# EAGLE board Z-ONE (EAGLE 7.2.0), part 1 of 2
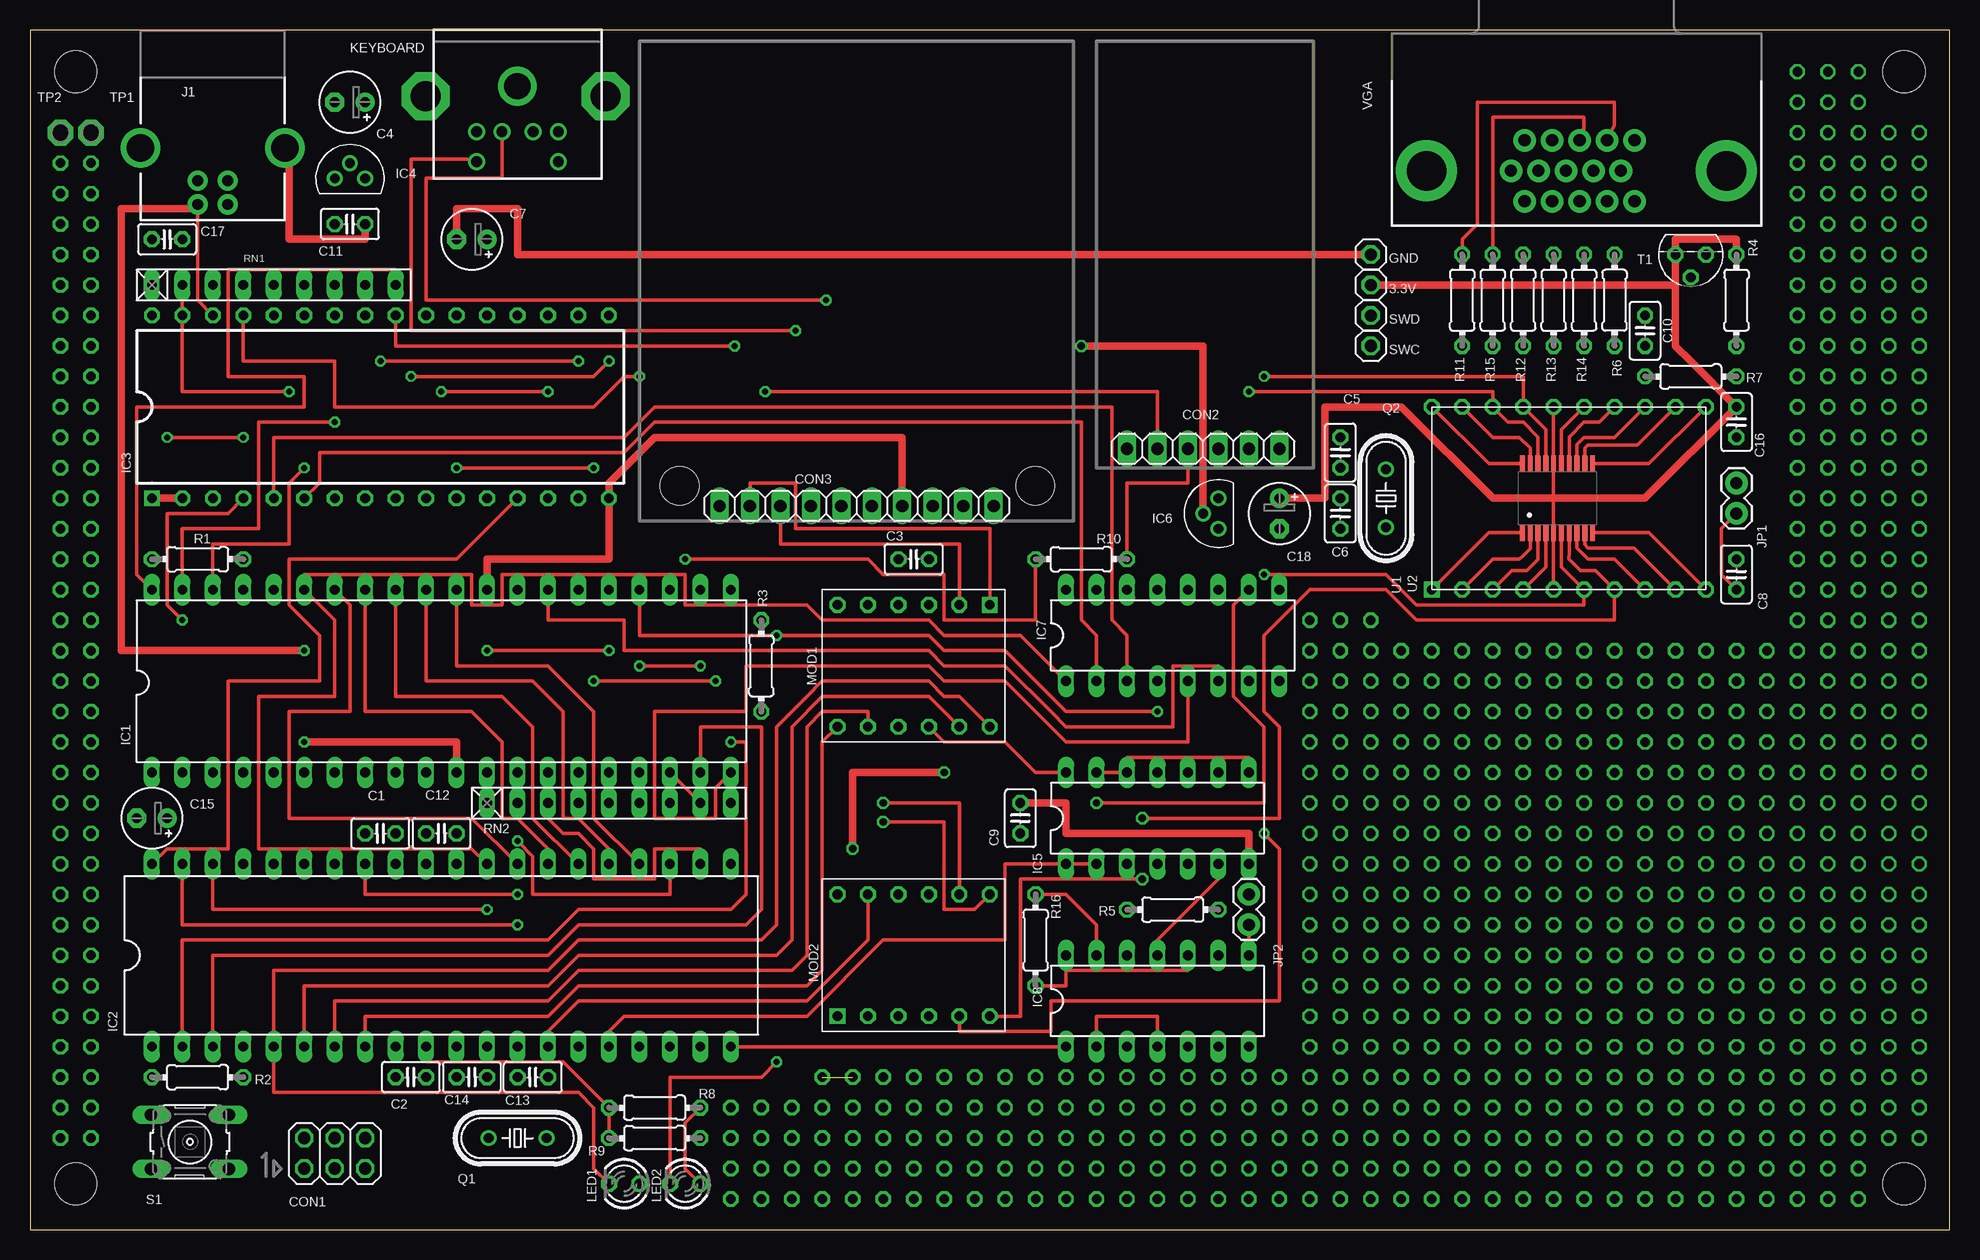
[diagram p1: board, top side]
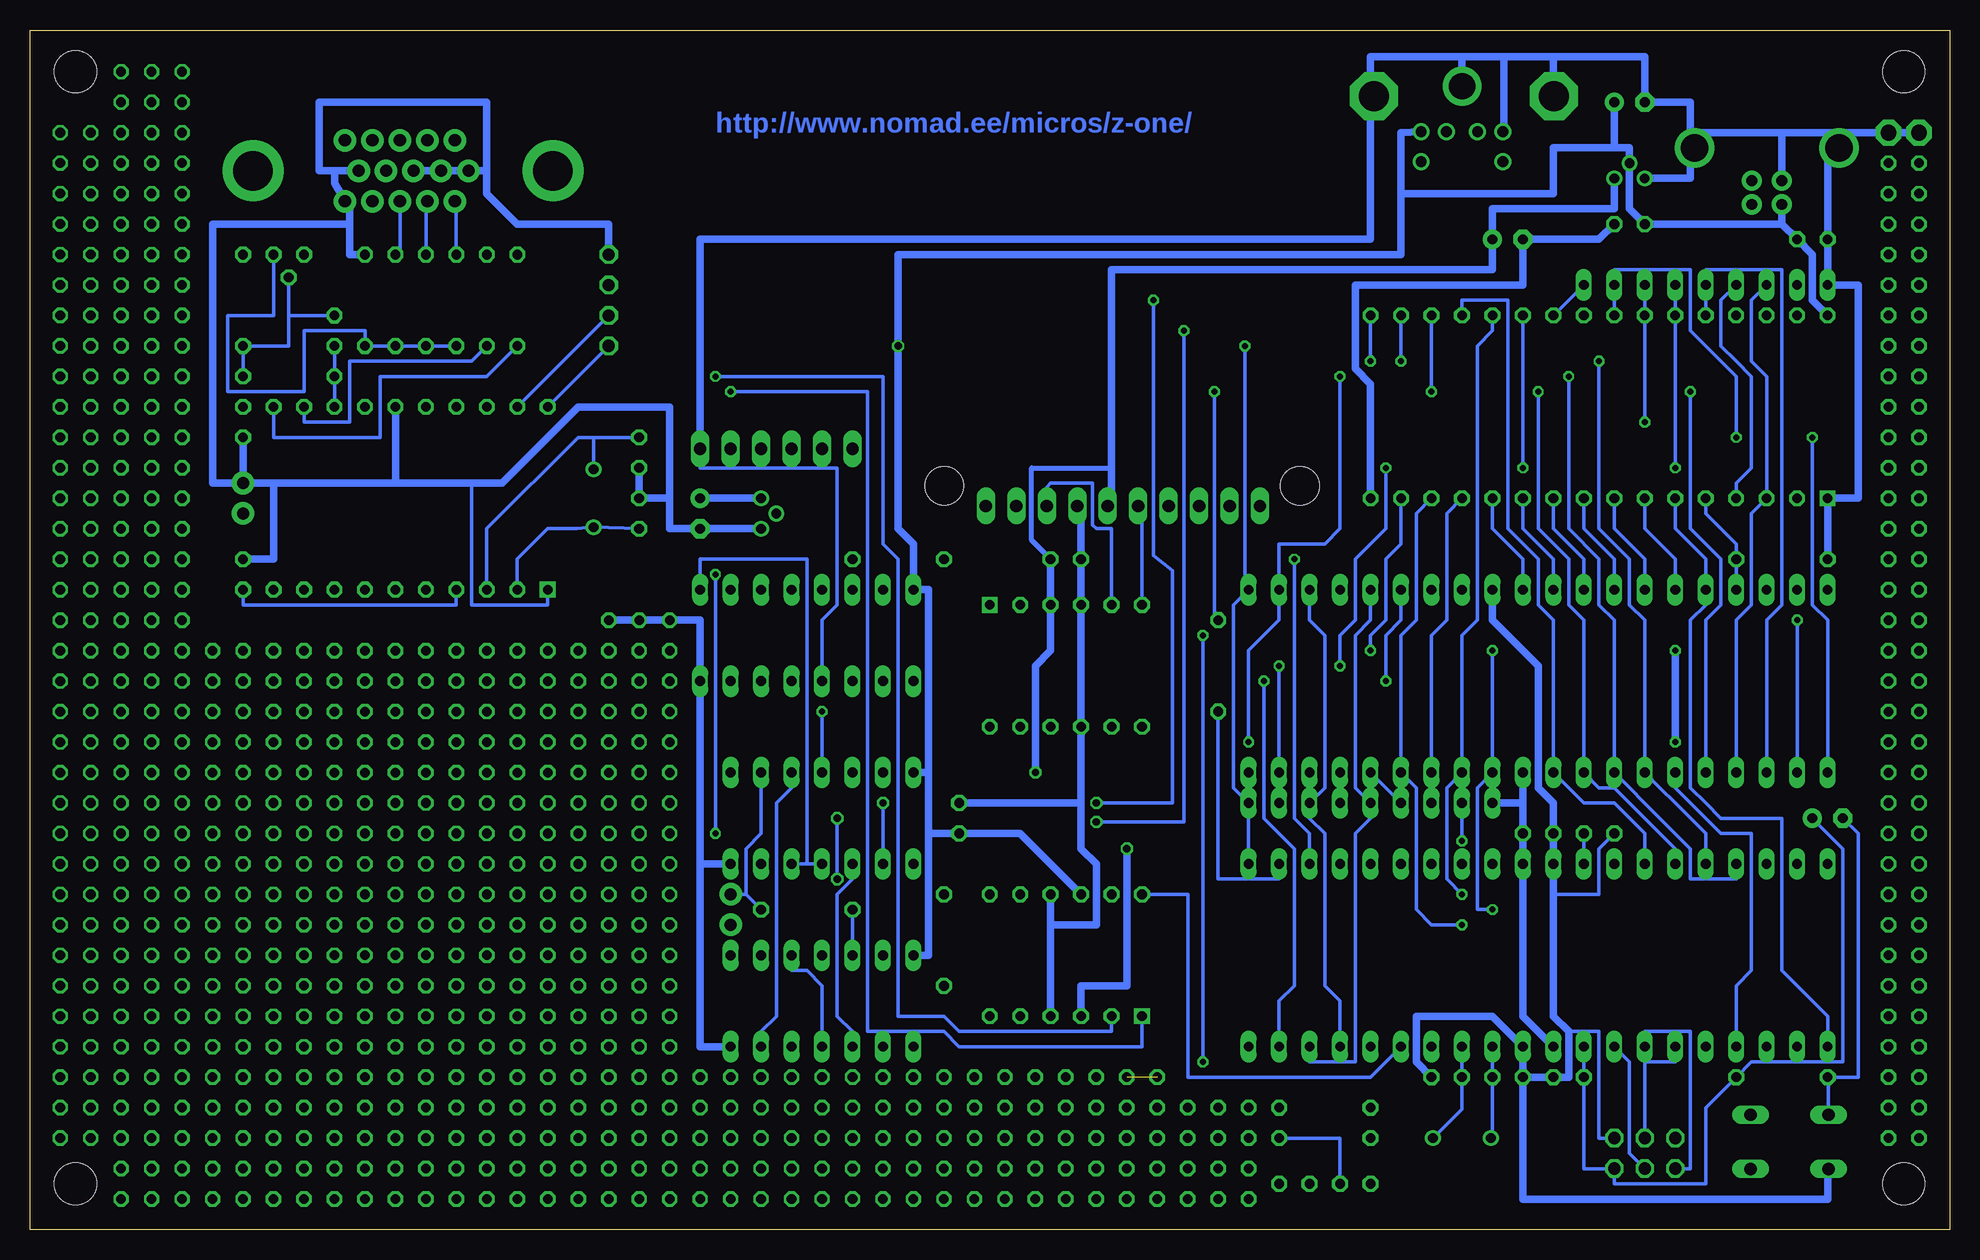
[diagram p2: board, bottom side, seen from below]

Size 160 x 100 mm. Coordinates in mm from the lower left corner, seen from the top.
Outline: 0,0 160,0 160,100 0,100 0,0
Copper layers (1*16): Top 0.035mm / dielectric 1.5mm / Bottom 0.035mm
Design rules "default *": minimum track width 10mil, minimum drill 0.3mm, track to track 10mil, track to pad 8mil, pad to pad 8mil, via to via 8mil, smd to smd 8mil, copper to edge 40mil, drill to drill 10mil, minimum pad ring 10mil, minimum via ring 8mil, stop-mask expansion 4mil, vias tented up to drill 0mil, thermal gap 10mil
Holes 3.5 mm at 3.81,96.52 3.81,3.81 156.21,3.81 156.21,96.52
Holes 3.2 mm at 83.78,62 54.14,62

## Footprints (pad centres in the part's own frame; a part is rotated, then mirrored left to right if it is on the bottom)
1X01 = drill 1.016 octagon: 1 0,0
C025-025X050 = drill 0.813 octagon: 1 -1.27,0; 2 1.27,0
E2,5-5 = drill 0.813 pad 1.6: + -1.27,0 | drill 0.813 pad 1.6 octagon: - 1.27,0
2X03 = drill 1.016 octagon: 1 -2.54,-1.27; 2 -2.54,1.27; 3 0,-1.27; 4 0,1.27; 5 2.54,-1.27; 6 2.54,1.27
1X06 = drill 1.016 long: 1 -6.35,0; 2 -3.81,0; 3 -1.27,0; 4 1.27,0; 5 3.81,0; 6 6.35,0
1X10 = drill 1.016 long: 1 -11.43,0; 2 -8.89,0; 3 -6.35,0; 4 -3.81,0; 5 -1.27,0; 6 1.27,0; 7 3.81,0; 8 6.35,0; 9 8.89,0; 10 11.43,0
DIL40 = drill 0.813 long: 1 -24.13,-7.62; 2 -21.59,-7.62; 3 -19.05,-7.62; 4 -16.51,-7.62; 5 -13.97,-7.62; 6 -11.43,-7.62; 7 -8.89,-7.62; 8 -6.35,-7.62; 9 -3.81,-7.62; 10 -1.27,-7.62; 11 1.27,-7.62; 12 3.81,-7.62; 13 6.35,-7.62; 14 8.89,-7.62; 15 11.43,-7.62; 16 13.97,-7.62; 17 16.51,-7.62; 18 19.05,-7.62; 19 21.59,-7.62; 20 24.13,-7.62; 21 24.13,7.62; 22 21.59,7.62; 23 19.05,7.62; 24 16.51,7.62; 25 13.97,7.62; 26 11.43,7.62; 27 8.89,7.62; 28 6.35,7.62; 29 3.81,7.62; 30 1.27,7.62; 31 -1.27,7.62; 32 -3.81,7.62; 33 -6.35,7.62; 34 -8.89,7.62; 35 -11.43,7.62; 36 -13.97,7.62; 37 -16.51,7.62; 38 -19.05,7.62; 39 -21.59,7.62; 40 -24.13,7.62
DIP32 = drill 0.8 square: 1 -7.62,19.05 | drill 0.8 octagon: 2 -7.62,16.51; 3 -7.62,13.97; 4 -7.62,11.43; 5 -7.62,8.89; 6 -7.62,6.35; 7 -7.62,3.81; 8 -7.62,1.27; 9 -7.62,-1.27; 10 -7.62,-3.81; 11 -7.62,-6.35; 12 -7.62,-8.89; 13 -7.62,-11.43; 14 -7.62,-13.97; 15 -7.62,-16.51; 16 -7.62,-19.05; 17 7.62,-19.05; 18 7.62,-16.51; 19 7.62,-13.97; 20 7.62,-11.43; 21 7.62,-8.89; 22 7.62,-6.35; 23 7.62,-3.81; 24 7.62,-1.27; 25 7.62,1.27; 26 7.62,3.81; 27 7.62,6.35; 28 7.62,8.89; 29 7.62,11.43; 30 7.62,13.97; 31 7.62,16.51; 32 7.62,19.05
TO-92 = drill 0.8: 1 0,1.27; 2 1.27,0; 3 0,-1.27
DIL14 = drill 0.813 long: 1 -7.62,-3.81; 2 -5.08,-3.81; 3 -2.54,-3.81; 4 0,-3.81; 5 2.54,-3.81; 6 5.08,-3.81; 7 7.62,-3.81; 8 7.62,3.81; 9 5.08,3.81; 10 2.54,3.81; 11 0,3.81; 12 -2.54,3.81; 13 -5.08,3.81; 14 -7.62,3.81
DIL16 = drill 0.813 long: 1 -8.89,-3.81; 2 -6.35,-3.81; 3 -3.81,-3.81; 4 -1.27,-3.81; 5 1.27,-3.81; 6 3.81,-3.81; 7 6.35,-3.81; 8 8.89,-3.81; 9 8.89,3.81; 10 6.35,3.81; 11 3.81,3.81; 12 1.27,3.81; 13 -1.27,3.81; 14 -3.81,3.81; 15 -6.35,3.81; 16 -8.89,3.81
USB-B-PTH = drill 0.914 pad 1.676: D+ 4,1.25; D- 5.981,1.25; GND 4,-1.25; VBUS 5.981,-1.25 | drill 2.286: SHLD1 1.282,-6.02; SHLD2 1.282,6.02
1X02 = drill 1.016 pad 1.88: 1 0,0; 2 2.54,0
MINI-DIN6 = drill 0.9: 1 -1.3,-8.5; 2 1.3,-8.5; 3 -3.4,-8.5; 4 3.4,-8.5; 5 -3.4,-11; 6 3.4,-11 | drill 2.2: P$1 0,-4.7
LED3MM = drill 0.813 octagon: A -1.27,0; K 1.27,0
LAVELSHIFTER_N = drill 0.8 square: 1 -6.35,-5.08 | drill 0.8 octagon: 2 -3.81,-5.08; 3 -1.27,-5.08; 4 1.27,-5.08; 5 3.81,-5.08; 6 6.35,-5.08; 7 6.35,5.08; 8 3.81,5.08; 9 1.27,5.08; 10 -1.27,5.08; 11 -3.81,5.08; 12 -6.35,5.08
HC49/S = drill 0.813: 1 -2.413,0; 2 2.413,0
0204/7 = drill 0.813 octagon: 1 -3.81,0; 2 3.81,0
RN-9 = drill 0.813 long: 1 -10.16,0; 2 -7.62,0; 3 -5.08,0; 4 -2.54,0; 5 0,0; 6 2.54,0; 7 5.08,0; 8 7.62,0; 9 10.16,0
B3F-10XX = drill 1.016 long: 1 -3.251,2.261; 2 3.251,2.261; 3 -3.251,-2.261; 4 3.251,-2.261
TO92 = drill 0.813 octagon: 1 1.27,0; 2 0,1.905; 3 -1.27,0
P1-13 = drill 1.321 pad 2.159 octagon: TP 0,0
DIL20WIDE = drill 0.813 square: 1 -7.62,12.7 | drill 0.813 octagon: 2 -7.62,10.16; 3 -7.62,7.62; 4 -7.62,5.08; 5 -7.62,2.54; 6 -7.62,0; 7 -7.62,-2.54; 8 -7.62,-5.08; 9 -7.62,-7.62; 10 -7.62,-10.16; 11 7.62,-10.16; 12 7.62,-7.62; 13 7.62,-5.08; 14 7.62,-2.54; 15 7.62,0; 16 7.62,2.54; 17 7.62,5.08; 18 7.62,7.62; 19 7.62,10.16; 20 7.62,12.7
MISC-PROCESSOR_TSSOP20 = smd 0.4 x 1.35: 1 -2.925,-2.875; 2 -2.275,-2.875; 3 -1.625,-2.875; 4 -0.975,-2.875; 5 -0.325,-2.875; 6 0.325,-2.875; 7 0.975,-2.875; 8 1.625,-2.875; 9 2.275,-2.875; 10 2.925,-2.875; 11 2.925,2.875; 12 2.275,2.875; 13 1.625,2.875; 14 0.975,2.875; 15 0.325,2.875; 16 -0.325,2.875; 17 -0.975,2.875; 18 -1.625,2.875; 19 -2.275,2.875; 20 -2.925,2.875
DB15 = drill 1.016 pad 1.88: 1 -4.32,-7.62; 2 -2.03,-7.62; 3 0.26,-7.62; 4 2.55,-7.62; 5 4.84,-7.62; 6 -5.46,-5.08; 7 -3.17,-5.08; 8 -0.88,-5.08; 9 1.41,-5.08; 10 3.7,-5.08; 11 -4.32,-2.54; 12 -2.03,-2.54; 13 0.26,-2.54; 14 2.55,-2.54; 15 4.84,-2.54 | drill 3.302 pad 5.08: G1 -12.5,-5.08; G2 12.5,-5.08

## Placement (x,y rotation side)
3.3V  [1X01]  111.76,78.74 0 top
C1  100n  [C025-025X050]  29.21,33.02 180 top
C2  100n  [C025-025X050]  31.75,12.7 180 top
C3  100n  [C025-025X050]  73.66,55.88 0 top
C4  10u  [E2,5-5]  26.67,93.98 180 top
C5  22p  [C025-025X050]  109.22,64.77 90 top
C6  22p  [C025-025X050]  109.22,59.69 270 top
C7  10u  [E2,5-5]  36.83,82.55 180 top
C8  100n  [C025-025X050]  142.24,54.61 90 top
C9  100n  [C025-025X050]  82.55,34.29 270 top
C10  22p  [C025-025X050]  134.62,74.93 90 top
C11  100n  [C025-025X050]  26.67,83.82 180 top
C12  100n  [C025-025X050]  34.29,33.02 0 top
C13  22p  [C025-025X050]  41.91,12.7 180 top
C14  22p  [C025-025X050]  36.83,12.7 0 top
C15  10u  [E2,5-5]  10.16,34.29 180 top
C16  100n  [C025-025X050]  142.24,67.31 270 top
C17  100n  [C025-025X050]  11.43,82.55 0 top
C18  10u  [E2,5-5]  104.14,59.69 270 top
CON1  AVRISP  [2X03]  25.4,6.35 0 top
CON2  USBSERIAL  [1X06]  97.79,65.09 180 top
CON3  SDCARD  [1X10]  68.9,60.33 0 top
GND  [1X01]  111.76,81.28 0 top
IC1  Z80  [DIL40]  34.29,45.72 0 top
IC2  ATMEGA1284P  [DIL40]  34.29,22.86 0 top
IC3  AS6C4008  [DIP32]  29.21,68.58 90 top
IC4  MCP1700 3.3V  [TO-92]  26.67,87.63 90 top
IC5  74HCT00N  [DIL14]  93.98,34.29 0 top
IC6  MCP1700 3.3V  [TO-92]  99.06,59.69 180 top
IC7  74HCT138N  [DIL16]  95.25,49.53 0 top
IC8  74HCT74N  [DIL14]  93.98,19.05 0 top
J1  USB_B_PTH  [USB-B-PTH]  15.24,91.44 270 top
JP1  STM32RESET  [1X02]  142.24,62.23 270 top
JP2  C0WAIT  [1X02]  101.6,25.4 90 top
KEYBOARD  MINI-DIN6PTH  [MINI-DIN6]  40.64,100.01 0 top
LED1  CARDACTIVE  [LED3MM]  49.53,3.81 180 top
LED2  Z80WAIT  [LED3MM]  54.61,3.81 180 top
MOD1  LEVELSHIFTER  [LAVELSHIFTER_N]  73.66,46.99 180 top
MOD2  LEVELSHIFTER  [LAVELSHIFTER_N]  73.66,22.86 0 top
Q1  18.432MHz  [HC49/S]  40.64,7.62 180 top
Q2  25MHz  [HC49/S]  113.03,60.96 90 top
R1  4k7  [0204/7]  13.97,55.88 0 top
R2  4k7  [0204/7]  13.97,12.7 0 top
R3  4k7  [0204/7]  60.96,46.99 270 top
R4  2K  [0204/7]  142.24,77.47 270 top
R5  4k7  [0204/7]  95.25,26.67 180 top
R6  470R  [0204/7]  132.08,77.47 90 top
R7  470R  [0204/7]  138.43,71.12 180 top
R8  470R  [0204/7]  52.07,10.16 180 top
R9  470R  [0204/7]  52.07,7.62 180 top
R10  470R  [0204/7]  87.63,55.88 0 top
R11  220R  [0204/7]  119.38,77.47 270 top
R12  220R  [0204/7]  124.46,77.47 270 top
R13  220R  [0204/7]  127,77.47 270 top
R14  220R  [0204/7]  129.54,77.47 270 top
R15  220R  [0204/7]  121.92,77.47 270 top
R16  4k7  [0204/7]  83.82,24.13 270 top
RN1  4k7  [RN-9]  20.32,78.74 0 top
RN2  4k7  [RN-9]  48.26,35.56 0 top
S1  RESET  [B3F-10XX]  13.34,7.3 0 top
SWC  [1X01]  111.76,73.66 0 top
SWD  [1X01]  111.76,76.2 0 top
T1  2N3904  [TO92]  138.43,81.28 180 top
TP1  GND  [P1-13]  5.08,91.44 0 top
TP2  GND  [P1-13]  2.54,91.44 0 top
U1  STM32F030F4P6  [DIL20WIDE]  129.54,60.96 90 top
U2  STM32F030F4P6  [MISC-PROCESSOR_TSSOP20]  127.32,60.96 0 top
VGA  DB15  [DB15]  128.91,93.34 0 top

## Tracks (layer width: path | path; a pad name or v marks a point on that pad's centre or on a via)
3V3_DISP
  Top 0.305: U1.5 U2.5 126.99,60.96 U2.16 U1.16 | 137.16,73.66 137.16,78.74
  Top 0.61: 137.16,78.74 3.3V.1 | R4.1 142.24,82.55 137.16,82.55 T1.1 137.16,78.74 | 137.16,78.74 137.16,73.66 138.43,72.39 C16.1 134.62,60.96 126.99,60.96 121.92,60.96 114.3,68.58 107.95,68.58 107.95,60.96 106.68,60.96 C18.+
  Bottom 0.61: IC6.3 C18.+
25MHZ
  Top 0.305: U2.3 125.69,55.84 124.78,54.93 123.51,54.93 U1.3
  Bottom 0.305: Q2.2 113.03,66.04 | 113.03,66.04 C5.2 | U1.3 121.92,58.42 114.3,66.04 113.03,66.04
!RESET
  Top 0.305: 140.97,54.61 140.97,58.42 | 140.97,58.42 JP1.2 | 140.97,54.61 140.97,58.42 | U2.4 126.34,55.22 U1.4 | 140.97,54.61 C8.1
  Bottom 0.305: U1.4 124.46,52.07 133.35,52.07 142.24,52.07 C8.1
+3.3V  (via drill 0.6 pad 0.61)
  Top 0.61: v68.58,31.75 68.58,38.1 v76.2,38.1
  Bottom 0.406: C3.2 76.52,57.47 76.52,63.5 69.85,63.5
  Bottom 0.61: CON3.6 69.85,60.96 69.85,63.5 69.85,79.69 69.85,80.01 38.1,80.01 C7.+ 38.1,85.09 27.94,85.09 27.94,86.36 IC4.3 | MOD2.3 72.39,20.32 71.12,20.32 68.58,20.32 v68.58,31.75 | C3.2 MOD1.3 74.93,48.26 76.2,46.99 v76.2,38.1
/AVR_RESET
  Bottom 0.305: IC2.9 C2.2 30.48,5.08 29.21,5.08 CON1.5 27.94,3.81 20.32,3.81 20.32,10.16 R2.2 16.51,13.97 8.89,13.97 8.89,31.75 C15.+
/BUSAK
  Bottom 0.305: IC1.23 53.34,50.8 52.07,49.53 52.07,36.83 RN2.7 53.34,34.29 52.07,33.02 52.07,20.32 50.8,19.05 IC2.17
/BUSRQ
  Bottom 0.305: IC1.25 48.26,50.8 49.53,49.53 49.53,36.83 RN2.5 48.26,34.29 49.53,33.02 49.53,13.97 53.34,13.97 IC2.18
/CARDCS
  Top 0.305: MOD1.12 77.47,44.45 76.2,44.45 74.93,45.72 66.04,45.72 64.77,44.45 62.23,41.91 62.23,31.75 62.23,30.48 62.23,25.4 60.96,24.13 58.42,24.13 45.72,24.13 43.18,21.59 20.32,21.59 IC2.5 20.32,11.43 45.72,11.43 46.99,10.16 46.99,5.08 LED1.K
/HALT
  Top 0.305: RN2.8 IC1.18
/INT
  Bottom 0.305: RN2.4 IC1.16
/IORQ
  Top 0.305: IC1.20 57.15,36.83 57.15,34.29 52.07,34.29 52.07,43.18 59.69,43.18 59.69,46.99 74.93,46.99 76.2,45.72 81.28,45.72 85.09,41.91 86.36,40.64 96.52,40.64 IC7.5
/IOSELA0  (via drill 0.6 pad 0.61)
  Top 0.305: IC5.2 IC5.1 85.09,30.48 81.28,30.48 81.28,24.13 71.12,24.13 64.77,17.78 49.53,17.78 48.26,16.51 IC2.16 | v88.9,35.56 102.87,35.56 102.87,41.91 100.33,44.45 100.33,52.07 IC7.10
  Bottom 0.305: IC5.2 v88.9,35.56
/IOSELC0
  Bottom 0.305: IC5.4 95.25,30.48 | 95.25,30.48 IC5.5 95.25,30.48 | 95.25,30.48 95.25,39.37 95.25,43.18 95.25,55.88 99.06,55.88 104.14,55.88 IC7.9
/M1
  Top 0.305: IC1.27 43.18,50.8 49.53,50.8 49.53,48.26 74.93,48.26 76.2,46.99 81.28,46.99 85.09,43.18 86.36,41.91 95.25,41.91 95.25,46.99 99.06,46.99 IC7.6
/MREQ  (via drill 0.5 pad 0.61)
  Top 0.305: IC2.3 15.24,22.86 43.18,22.86 45.72,25.4 58.42,25.4 59.69,25.4 60.96,26.67 60.96,30.48 60.96,31.75 60.96,41.91 55.88,41.91 IC1.19 | v55.88,46.99 v50.8,46.99 | v35.56,63.5 v46.99,63.5 v35.56,63.5
  Bottom 0.305: IC3.22 v35.56,63.5 | IC1.19 v55.88,46.99 | v50.8,46.99 50.8,49.53 49.53,50.8 49.53,55.88 46.99,58.42 v46.99,63.5
/NMI
  Bottom 0.305: IC1.17 RN2.6
/RD  (via drill 0.5 pad 0.61)
  Top 0.305: v58.74,73.66 30.48,73.66 IC3.24
  Bottom 0.305: v58.74,73.66 58.74,53.66 IC1.21 59.69,52.07 59.69,36.83 RN2.9 IC2.21
/RESET  (via drill 0.5 pad 0.61)
  Top 0.305: v57.15,45.72 v46.99,45.72
  Bottom 0.305: IC1.26 45.72,50.8 46.99,49.53 v46.99,45.72 | IC2.19 55.88,19.05 54.61,20.32 54.61,31.75 57.15,34.29 v57.15,45.72
/RESUME1
  Top 0.305: IC8.1 85.09,15.24 59.69,15.24 IC2.20
/RESUME2
  Top 0.305: IC8.13 88.9,25.4 86.36,27.94 R16.1
/WAIT  (via drill 0.5 pad 0.41, 0.5 pad 0.61)
  Top 0.305: IC1.24 50.8,50.8 50.8,49.53 | 50.8,49.53 v62.23,49.53 | v62.23,49.53 73.66,49.53 74.93,49.53 76.2,48.26 81.28,48.26 86.36,43.18 v93.98,43.18 | LED2.K 53.34,12.7 60.96,12.7 v62.23,13.97 | v62.23,49.53 50.8,49.53
  Bottom 0.305: v93.98,43.18 93.98,41.91 93.98,39.37 IC5.11 | v62.23,13.97 v62.23,49.53
/WR  (via drill 0.5 pad 0.61)
  Top 0.305: IC2.2 12.7,24.13 43.18,24.13 45.72,26.67 58.42,26.67 59.69,27.94 59.69,31.75 59.69,39.37 59.69,40.64 v58.42,40.64 | v50.8,71.12 49.53,71.12 46.99,68.58 44.45,68.58 25.4,68.58 25.4,72.39 19.05,72.39 17.78,72.39 IC3.29
  Bottom 0.305: v50.8,71.12 50.8,58.42 52.07,57.15 55.88,57.15 IC1.22 55.88,50.8 58.42,48.26 v58.42,40.64
A0
  Top 0.305: IC2.24 46.99,34.29 46.99,43.18 45.72,44.45 43.18,46.99 35.56,46.99 35.56,48.26 IC1.30
  Bottom 0.305: IC1.30 35.56,55.88 38.1,58.42 IC3.12
A1
  Top 0.305: IC2.25 48.26,31.75 45.72,34.29 44.45,34.29 44.45,43.18 41.91,45.72 33.02,45.72 IC1.31
  Bottom 0.305: IC1.31 33.02,55.88 35.56,58.42 IC3.11
A2
  Top 0.305: IC2.26 41.91,34.29 41.91,41.91 39.37,44.45 30.48,44.45 30.48,45.72 IC1.32
  Bottom 0.305: IC1.32 30.48,55.88 33.02,58.42 IC3.10
A3
  Top 0.305: IC2.27 43.18,31.75 40.64,34.29 39.37,34.29 39.37,40.64 36.83,43.18 27.94,43.18 27.94,44.45 IC1.33
  Bottom 0.305: IC1.33 27.94,55.88 30.48,58.42 IC3.9
A4
  Top 0.305: IC2.28 36.83,34.29 21.59,34.29 21.59,43.18 25.4,43.18 26.67,43.18 26.67,52.07 IC1.34
  Bottom 0.305: IC1.34 25.4,55.88 27.94,58.42 IC3.8
A5
  Top 0.305: IC2.29 36.83,31.75 20.32,31.75 19.05,31.75 19.05,43.18 19.05,44.45 24.13,44.45 25.4,44.45 25.4,50.8 24.13,52.07 IC1.35 22.86,54.61 25.4,54.61 36.83,54.61 36.83,52.07 39.37,52.07 39.37,54.61 54.61,54.61 54.61,52.07 64.77,52.07 66.04,50.8 74.93,50.8 76.2,49.53 82.55,49.53 IC7.1
  Bottom 0.305: IC1.35 22.86,55.88 25.4,58.42 IC3.7
A6
  Top 0.305: IC3.6 24.13,62.23 24.13,63.5 24.13,64.77 49.53,64.77 52.07,67.31 87.63,67.31 87.63,50.8 88.9,49.53 IC7.2
  Bottom 0.305: 22.86,58.42 20.32,55.88 IC1.36 20.32,52.07 21.59,50.8 21.59,36.83 20.32,35.56 19.05,34.29 13.97,34.29 13.97,21.59 10.16,17.78 IC2.1 | 22.86,58.42 IC3.6 22.86,58.42
A7
  Top 0.305: IC3.5 20.32,66.04 49.53,66.04 52.07,68.58 90.17,68.58 90.17,57.15 90.17,54.61 90.17,50.8 91.44,49.53 IC7.3
  Bottom 0.305: IC1.37 R1.2 17.78,57.15 19.05,58.42 20.32,59.69 | 20.32,59.69 IC3.5 20.32,59.69
A8  (via drill 0.5 pad 0.61)
  Top 0.305: IC1.38 15.24,57.15 21.59,57.15 21.59,62.23 v22.86,63.5
  Bottom 0.305: RN1.6 IC3.27 v22.86,63.5
A9  (via drill 0.5 pad 0.61)
  Top 0.305: v25.4,67.31 19.05,67.31 19.05,66.04 19.05,58.42 12.7,58.42 12.7,57.15 IC1.39
  Bottom 0.305: RN1.7 IC3.26 v25.4,67.31
A10
  Top 0.305: IC1.40 8.89,54.61 8.89,68.58 22.86,68.58 22.86,71.12 16.51,71.12 16.51,73.66 16.51,80.01 29.21,80.01 30.48,80.01 RN1.9
  Bottom 0.305: RN1.9 IC3.23
A11  (via drill 0.5 pad 0.61)
  Top 0.305: v11.43,66.04 v17.78,66.04
  Bottom 0.305: RN1.8 IC3.25 27.94,80.01 21.59,80.01 21.59,74.93 20.32,73.66 19.05,72.39 17.78,71.12 v17.78,66.04 | IC1.1 10.16,50.8 11.43,52.07 v11.43,66.04
A12  (via drill 0.5 pad 0.61)
  Top 0.305: v12.7,50.8 11.43,52.07 11.43,59.69 16.51,59.69 IC3.4
  Bottom 0.305: IC3.4 17.78,62.23 16.51,63.5 16.51,71.12 17.78,72.39 19.05,73.66 19.05,77.47 RN1.4 | IC1.2 v12.7,50.8
A13
  Bottom 0.305: RN1.5 IC3.28 RN1.5 | IC1.3 15.24,50.8 13.97,52.07 13.97,80.01 20.32,80.01 RN1.5
A14
  Bottom 0.305: IC1.4 17.78,50.8 16.51,52.07 16.51,59.69 IC3.3 15.24,71.12 16.51,72.39 16.51,77.47 RN1.3
A15  (via drill 0.5 pad 0.61)
  Top 0.305: RN1.2 IC3.31 12.7,69.85 v21.59,69.85
  Bottom 0.305: IC1.5 20.32,50.8 19.05,52.07 19.05,55.88 21.59,58.42 21.59,67.31 v21.59,69.85
B
  Bottom 0.305: VGA.3 129.16,81.66 R14.1
D0
  Top 0.305: IC2.40 11.43,31.75 16.51,31.75 16.51,45.72 24.13,45.72 24.13,49.53 22.86,50.8 21.59,52.07 21.59,55.88 35.56,55.88 38.1,58.42 39.37,59.69 IC3.13
  Bottom 0.305: IC1.14 43.18,49.53 41.91,50.8 41.91,59.69 IC3.13
D1  (via drill 0.5 pad 0.61)
  Top 0.305: IC2.39 12.7,25.4 v40.64,25.4
  Bottom 0.305: IC3.14 44.45,59.69 44.45,50.8 45.72,49.53 IC1.15 44.45,36.83 44.45,26.67 43.18,25.4 v40.64,25.4
D2  (via drill 0.5 pad 0.61)
  Top 0.305: IC2.38 15.24,26.67 v38.1,26.67 | v38.1,48.26 v48.26,48.26
  Bottom 0.305: v38.1,26.67 39.37,26.67 39.37,36.83 IC1.12 v38.1,48.26 | v48.26,48.26 48.26,49.53 46.99,50.8 46.99,55.88 45.72,57.15 IC3.15
D3  (via drill 0.5 pad 0.61)
  Top 0.305: v31.75,71.12 46.99,71.12 v48.26,72.39
  Bottom 0.305: IC2.37 17.78,29.21 21.59,29.21 21.59,31.75 24.13,34.29 IC1.8 27.94,45.72 27.94,50.8 29.21,52.07 29.21,55.88 31.75,58.42 31.75,66.04 v31.75,71.12 | v48.26,72.39 IC3.17
D4  (via drill 0.5 pad 0.61)
  Top 0.305: v29.21,72.39 v45.72,72.39
  Bottom 0.305: IC2.36 20.32,33.02 22.86,35.56 24.13,36.83 IC1.7 25.4,45.72 25.4,50.8 26.67,52.07 26.67,55.88 29.21,58.42 29.21,66.04 v29.21,72.39 | v45.72,72.39 IC3.18
D5  (via drill 0.5 pad 0.61)
  Top 0.305: v34.29,69.85 v43.18,69.85
  Bottom 0.305: IC2.35 22.86,31.75 24.13,33.02 26.67,35.56 27.94,36.83 29.21,36.83 IC1.9 30.48,45.72 30.48,50.8 31.75,52.07 31.75,55.88 34.29,58.42 34.29,66.04 v34.29,69.85 | v43.18,69.85 IC3.19
D6
  Bottom 0.305: IC2.34 25.4,33.02 27.94,35.56 30.48,35.56 IC1.10 33.02,45.72 33.02,50.8 34.29,52.07 34.29,55.88 36.83,58.42 36.83,66.04 36.83,68.58 36.83,77.47 40.64,77.47 IC3.20
D7  (via drill 0.5 pad 0.61)
  Top 0.305: IC2.33 27.94,27.94 v40.64,27.94
  Bottom 0.305: IC3.21 38.1,74.93 39.37,73.66 39.37,50.8 40.64,49.53 IC1.13 41.91,36.83 41.91,29.21 v40.64,27.94
G
  Bottom 0.305: R13.1 127,86.23 VGA.2
GND  (via drill 0.8 pad 1.27)
  Top 0.305: 21.59,90.17 21.27,90.17 | U2.1 121.58,58.09 U1.1 | U2.15 127.64,66.68 U1.15
  Top 0.61: IC3.2 IC3.1 | C11.1 27.94,82.55 21.59,82.55 21.59,90.17 | 21.27,90.17 J1.SHLD2 | IC1.29 38.1,55.88 48.26,55.88 48.26,58.42 IC3.16 48.26,62.23 52.07,66.04 72.71,66.04 72.71,63.5 72.71,60.64 CON3.7 | C7.- 35.56,85.09 40.64,85.09 40.64,81.28 GND.1 | IC5.7 101.6,33.02 86.36,33.02 86.36,35.56 C9.1
  Bottom 0.305: VGA.10 134.62,88.27 | C1.2 29.21,31.75 29.21,27.94 33.02,27.94 | CON1.6 29.21,7.62 29.21,13.97 29.21,16.51 31.75,16.51 | IC7.4 93.98,50.8 92.71,52.07 92.71,63.5 104.14,63.5 104.14,64.77 | U1.1 116.84,52.07 123.19,52.07 123.19,54.61 123.19,62.23 124.46,62.23 129.54,62.23 | 104.14,64.77 CON2.1 104.14,64.77
  Bottom 0.61: 13.99,91.42 J1.GND 13.99,91.42 | 13.99,91.42 13.97,91.44 | 13.97,91.44 8.89,91.44 | 8.89,91.44 8.89,90.49 J1.SHLD1 10.16,89.22 10.16,88.9 C17.1 | 13.99,91.42 13.97,91.44 | 13.97,91.44 21.59,91.44 | 21.59,91.44 21.59,90.49 J1.SHLD2 21.59,89.83 21.59,87.63 IC4.1 | 21.59,91.44 21.59,93.98 C4.- 25.4,97.79 33.02,97.79 | RN1.1 C17.1 | RN1.1 7.62,78.74 7.62,60.96 IC3.1 R1.1 | C11.1 29.21,82.55 C7.- 35.56,78.74 49.53,78.74 49.53,71.75 48.26,70.48 IC3.16 | 36.83,97.79 37.15,97.79 37.15,91.61 KEYBOARD.3 | 36.83,97.79 33.02,97.79 | 104.14,30.48 IC7.8 104.14,50.8 v106.68,50.8 | 104.14,30.48 IC5.7 104.14,30.48 | 104.14,30.48 104.14,15.24 IC8.7 | v106.68,50.8 v111.76,50.8 | IC2.11 C14.1 | C13.1 44.45,13.97 44.45,17.78 38.1,17.78 IC2.11 | IC2.11 35.56,2.54 | 35.56,2.54 C14.1 | C14.1 C2.1 31.75,12.7 31.75,16.51 33.02,17.78 33.02,27.94 IC2.31 C12.1 33.02,35.56 34.29,36.83 34.29,46.99 38.1,50.8 IC1.29 | S1.3 10.16,4.97 10.16,2.54 33.02,2.54 35.56,2.54 | R6.2 133.35,81.28 133.35,83.82 | 133.35,83.82 133.35,85.97 VGA.5 134.62,87.23 134.62,88.27 | U1.15 129.54,62.23 | 129.54,62.23 139.7,62.23 | 139.7,62.23 JP1.1 | VGA.8 VGA.7 VGA.6 121.92,88.27 | GND.1 111.76,83.82 116.84,83.82 119.38,83.82 121.92,86.36 121.92,88.27 | JP1.1 144.78,62.23 144.78,83.82 133.35,83.82 | C8.2 140.97,55.88 139.7,55.88 139.7,62.23 | 139.7,62.23 JP1.1 | VGA.10 134.62,88.27 | 134.62,88.27 135.89,88.27 135.89,93.98 121.92,93.98 121.92,88.27 | CON3.7 72.39,60.01 72.39,59.05 C3.1 MOD1.4 72.39,49.53 72.39,48.26 MOD1.9 72.39,35.56 | MOD2.4 74.93,22.86 74.93,26.67 MOD2.9 74.93,25.4 71.12,25.4 71.12,30.48 72.39,31.75 72.39,35.56 | 33.02,97.79 33.02,96.52
  Bottom 0.61: 36.83,97.79 40.64,97.79 | 40.64,97.79 40.64,96.52 | 40.64,97.79 48.26,97.79 48.26,95.89 48.26,82.55 104.14,82.55 CON2.1 | C9.1 72.39,35.56 | 8.89,91.44 TP1.TP TP2.TP | v109.22,50.8 v106.68,50.8 | C17.1 RN1.1 | 106.68,60.96 106.68,58.42 C18.- IC6.1 | 106.68,60.96 106.68,68.58 114.3,68.58 120.65,62.23 123.19,62.23 124.46,62.23 129.54,62.23 | C5.1 C6.1 106.68,60.96 | C16.2 JP1.1
HSYNC
  Top 0.305: R15.1 121.92,92.71 129.54,92.71 129.54,91.81 VGA.13
MISO
  Top 0.305: IC2.7 25.4,19.05 43.18,19.05 45.72,21.59 58.42,21.59 63.5,21.59 64.77,22.86 64.77,30.48 64.77,31.75 | 64.77,31.75 64.77,41.91 | 64.77,31.75 64.77,41.91 | 64.77,41.91 66.04,43.18 69.85,43.18 MOD1.8
  Bottom 0.305: CON1.1 21.59,5.08 21.59,16.51 25.4,16.51 IC2.7
MOSI
  Top 0.305: IC2.6 22.86,20.32 43.18,20.32 45.72,22.86 58.42,22.86 62.23,22.86 63.5,24.13 63.5,30.48 63.5,31.75 63.5,41.91 66.04,44.45 74.93,44.45 MOD1.11
  Bottom 0.305: CON1.4 25.4,13.97 22.86,13.97 IC2.6
N$1
  Top 0.305: U2.2 125.04,56.78 124.46,56.2 124.14,55.88 121.92,55.88 U1.2
  Bottom 0.305: C6.2 Q2.1 114.43,58.42 116.84,58.42 119.38,55.88 U1.2
N$2
  Top 0.305: U2.12 129.59,65.14 129.86,65.41 133.99,65.41 U1.12
  Bottom 0.305: U1.12 137.16,67.31 133.35,67.31 133.35,72.39 123.19,72.39 R15.2
N$3
  Bottom 0.305: IC8.3 91.44,16.51 92.71,17.78 92.71,27.94 91.44,29.21 IC5.3
N$4
  Bottom 0.305: R12.2 R13.2 R14.2 R6.1 132.08,74.93 137.16,74.93 137.16,69.85 143.51,69.85 143.51,76.2 139.7,76.2 T1.3
N$5
  Bottom 0.305: IC2.12 C14.2 38.1,7.75 Q1.2
N$6
  Bottom 0.305: IC2.32 30.48,31.75 C1.1
N$7  (via drill 0.8 pad 1.27)
  other vias: 152.4,5.08
N$8
  Top 0.305: U2.11 134.96,63.84 U1.11
  Bottom 0.305: U1.11 139.7,66.04 130.81,66.04 130.81,71.12 121.92,71.12 R11.2
N$9  (via drill 0.6 pad 0.61)
  Top 0.305: v92.71,34.29 95.25,34.29 104.14,34.29 104.14,41.91 102.87,43.18 102.87,49.53 104.14,50.8 106.68,53.34 113.03,53.34 114.3,52.07 115.57,50.8 132.08,50.8 U1.7 130.49,54.93 129.22,54.93 128.27,55.88 128.29,56.54 U2.7 | MOD2.6 82.55,17.78 82.55,29.21 v92.71,29.21
  Bottom 0.305: v92.71,29.21 v92.71,34.29
N$10  (via drill 0.5 pad 0.41, 0.5 pad 0.61)
  Top 0.305: v102.87,33.02 104.14,31.75 104.14,19.05 95.25,19.05 85.09,19.05 85.09,16.51 77.47,16.51 MOD2.5 | v102.87,54.61 113.03,54.61 115.57,52.07 129.54,52.07 U1.6 127.64,55.24 U2.6
  Bottom 0.305: v102.87,33.02 102.87,48.26 v102.87,54.61
N$11
  Bottom 0.305: R7.1 R4.2 138.43,73.66 138.43,76.2 | 138.43,76.2 T1.2 138.43,76.2 | 138.43,76.2 C10.2
N$12
  Top 0.305: U2.13 128.94,65.44 129.54,66.04 132.08,66.04 U1.13
  Bottom 0.305: C10.1 R7.2 U1.13
N$13  (via drill 0.8 pad 1.27)
  other vias: 152.4,2.54
N$14
  Top 0.305: U2.8 128.94,56.8 129.86,55.88 132.08,55.88 U1.8
N$15  (via drill 0.5 pad 0.61)
  Top 0.305: CON2.5 93.98,69.85 v61.28,69.85
  Bottom 0.305: v61.28,69.85 61.28,51.12 R3.1
N$16
  Top 0.305: CON3.3 62.55,59.69 62.55,57.15 66.04,57.15 68.58,57.15 69.85,57.15 77.47,57.15 MOD1.2
N$17
  Bottom 0.305: 100.33,27.94 JP2.2 100.33,27.94 | 100.33,27.94 100.33,31.75 99.06,33.02 IC5.9 | R5.1 100.33,27.94
N$18
  Bottom 0.305: CON3.8 75.25,61.91 74.93,62.23 71.44,62.23 71.44,58.74 71.12,58.42 69.85,58.42 MOD1.5
N$19
  Bottom 0.305: MOD1.6 67.31,60.01 CON3.5
N$20
  Top 0.305: IC8.11 93.98,24.13 97.79,27.94 99.06,29.21 IC5.6
N$21
  Bottom 0.305: IC2.13 C13.2 40.64,10.16 40.64,10.03 Q1.1
N$22
  Top 0.305: U2.9 129.59,57.1 129.86,56.83 133.67,56.83 U1.9
N$23  (via drill 0.8 pad 1.27)
  other vias: 106.68,2.54
N$24
  Top 0.305: JP2.1 IC8.8
N$25  (via drill 0.8 pad 1.27)
  other vias: 109.22,2.54
N$26  (via drill 0.8 pad 1.27)
  other vias: 106.68,5.08
N$27  (via drill 0.8 pad 1.27)
  other vias: 106.68,7.62
N$28  (via drill 0.8 pad 1.27)
  other vias: 106.68,10.16
N$29  (via drill 0.8 pad 1.27)
  other vias: 106.68,12.7
N$30  (via drill 0.8 pad 1.27)
  other vias: 106.68,15.24
N$31  (via drill 0.8 pad 1.27)
  other vias: 106.68,17.78
N$32  (via drill 0.8 pad 1.27)
  other vias: 106.68,20.32
N$33  (via drill 0.8 pad 1.27)
  other vias: 106.68,22.86
N$34  (via drill 0.8 pad 1.27)
  other vias: 106.68,25.4
N$35  (via drill 0.8 pad 1.27)
  other vias: 106.68,27.94
N$36  (via drill 0.8 pad 1.27)
  other vias: 106.68,30.48
N$37  (via drill 0.8 pad 1.27)
  other vias: 106.68,33.02
N$38  (via drill 0.8 pad 1.27)
  other vias: 106.68,35.56
N$39  (via drill 0.8 pad 1.27)
  other vias: 106.68,38.1
N$40  (via drill 0.8 pad 1.27)
  other vias: 106.68,40.64
N$41  (via drill 0.8 pad 1.27)
  other vias: 106.68,43.18
N$42  (via drill 0.8 pad 1.27)
  other vias: 109.22,45.72
N$43  (via drill 0.8 pad 1.27)
  other vias: 109.22,48.26
N$44  (via drill 0.8 pad 1.27)
  other vias: 104.14,12.7
N$45  (via drill 0.8 pad 1.27)
  other vias: 111.76,2.54
N$46  (via drill 0.8 pad 1.27)
  other vias: 114.3,2.54
N$47  (via drill 0.8 pad 1.27)
  other vias: 116.84,2.54
N$48  (via drill 0.8 pad 1.27)
  other vias: 119.38,2.54
N$49  (via drill 0.8 pad 1.27)
  other vias: 121.92,2.54
N$50  (via drill 0.8 pad 1.27)
  other vias: 124.46,2.54
N$51  (via drill 0.8 pad 1.27)
  other vias: 127,2.54
N$52  (via drill 0.8 pad 1.27)
  other vias: 129.54,2.54
N$53  (via drill 0.8 pad 1.27)
  other vias: 132.08,2.54
N$54  (via drill 0.8 pad 1.27)
  other vias: 134.62,2.54
N$55  (via drill 0.8 pad 1.27)
  other vias: 137.16,2.54
N$56  (via drill 0.8 pad 1.27)
  other vias: 139.7,2.54
N$57  (via drill 0.8 pad 1.27)
  other vias: 142.24,2.54
N$58  (via drill 0.8 pad 1.27)
  other vias: 144.78,2.54
N$59  (via drill 0.8 pad 1.27)
  other vias: 147.32,2.54
N$60  (via drill 0.8 pad 1.27)
  other vias: 149.86,2.54
N$61  (via drill 0.8 pad 1.27)
  other vias: 101.6,12.7
N$62  (via drill 0.8 pad 1.27)
  other vias: 99.06,12.7
N$63  (via drill 0.8 pad 1.27)
  other vias: 96.52,12.7
N$64  (via drill 0.8 pad 1.27)
  other vias: 93.98,12.7
N$65  (via drill 0.8 pad 1.27)
  other vias: 91.44,12.7
N$66  (via drill 0.8 pad 1.27)
  other vias: 88.9,12.7
N$67  (via drill 0.8 pad 1.27)
  other vias: 86.36,12.7
N$68  (via drill 0.8 pad 1.27)
  other vias: 83.82,12.7
N$69  (via drill 0.8 pad 1.27)
  other vias: 81.28,12.7
N$70  (via drill 0.8 pad 1.27)
  other vias: 78.74,12.7
N$71  (via drill 0.8 pad 1.27)
  other vias: 76.2,12.7
N$72  (via drill 0.8 pad 1.27)
  other vias: 73.66,12.7
N$73  (via drill 0.8 pad 1.27)
  other vias: 71.12,12.7
N$74  (via drill 0.8 pad 1.27)  (1 unrouted)
  other vias: 68.58,12.7 66.04,12.7
N$75  (via drill 0.8 pad 1.27)
  other vias: 147.32,50.8
N$76  (via drill 0.8 pad 1.27)
  other vias: 149.86,50.8
N$77  (via drill 0.8 pad 1.27)
  other vias: 152.4,50.8
N$78  (via drill 0.8 pad 1.27)
  other vias: 154.94,50.8
N$79  (via drill 0.8 pad 1.27)
  other vias: 154.94,48.26
N$80  (via drill 0.8 pad 1.27)
  other vias: 154.94,45.72
N$81  (via drill 0.8 pad 1.27)
  other vias: 154.94,43.18
N$82  (via drill 0.8 pad 1.27)
  other vias: 154.94,40.64
N$83  (via drill 0.8 pad 1.27)
  other vias: 154.94,38.1
N$84  (via drill 0.8 pad 1.27)
  other vias: 154.94,35.56
N$85  (via drill 0.8 pad 1.27)
  other vias: 154.94,33.02
N$86  (via drill 0.8 pad 1.27)
  other vias: 154.94,30.48
N$87  (via drill 0.8 pad 1.27)
  other vias: 154.94,27.94
N$88  (via drill 0.8 pad 1.27)
  other vias: 154.94,25.4
N$89  (via drill 0.8 pad 1.27)
  other vias: 154.94,22.86
N$90  (via drill 0.8 pad 1.27)
  other vias: 154.94,20.32
N$91  (via drill 0.8 pad 1.27)
  other vias: 154.94,17.78
N$92  (via drill 0.8 pad 1.27)
  other vias: 154.94,15.24
N$93  (via drill 0.8 pad 1.27)
  other vias: 154.94,12.7
N$94  (via drill 0.8 pad 1.27)
  other vias: 154.94,10.16
N$95  (via drill 0.8 pad 1.27)
  other vias: 154.94,7.62
N$96  (via drill 0.8 pad 1.27)
  other vias: 152.4,7.62
N$97  (via drill 0.8 pad 1.27)
  other vias: 149.86,7.62
N$98  (via drill 0.8 pad 1.27)
  other vias: 149.86,5.08
N$99  (via drill 0.8 pad 1.27)
  other vias: 104.14,2.54
N$100  (via drill 0.8 pad 1.27)
  other vias: 104.14,5.08
N$101  (via drill 0.8 pad 1.27)
  other vias: 104.14,7.62
N$102  (via drill 0.8 pad 1.27)
  other vias: 104.14,10.16
N$103
  Top 0.305: U2.10 134.96,58.09 U1.10
N$104
  Top 0.305: R10.2 91.44,62.23 96.52,62.23 CON2.4
N$105  (via drill 0.8 pad 1.27)
  other vias: 106.68,48.26
N$106  (via drill 0.8 pad 1.27)
  other vias: 106.68,45.72
N$107  (via drill 0.8 pad 1.27)
  other vias: 109.22,43.18
N$108  (via drill 0.8 pad 1.27)
  other vias: 109.22,40.64
N$109  (via drill 0.8 pad 1.27)
  other vias: 109.22,38.1
N$110  (via drill 0.8 pad 1.27)
  other vias: 109.22,35.56
N$111  (via drill 0.8 pad 1.27)
  other vias: 109.22,33.02
N$112  (via drill 0.8 pad 1.27)
  other vias: 109.22,30.48
N$113  (via drill 0.8 pad 1.27)
  other vias: 109.22,27.94
N$114  (via drill 0.8 pad 1.27)
  other vias: 109.22,25.4
N$115  (via drill 0.8 pad 1.27)
  other vias: 109.22,22.86
N$116  (via drill 0.8 pad 1.27)
  other vias: 109.22,20.32
N$117  (via drill 0.8 pad 1.27)
  other vias: 109.22,17.78
N$118  (via drill 0.8 pad 1.27)
  other vias: 109.22,15.24
N$119  (via drill 0.8 pad 1.27)
  other vias: 109.22,12.7
N$120  (via drill 0.8 pad 1.27)
  other vias: 109.22,10.16
N$121  (via drill 0.8 pad 1.27)
  other vias: 109.22,7.62
N$122  (via drill 0.8 pad 1.27)
  other vias: 111.76,48.26
N$123  (via drill 0.8 pad 1.27)
  other vias: 114.3,48.26
N$124  (via drill 0.8 pad 1.27)
  other vias: 116.84,48.26
N$125  (via drill 0.8 pad 1.27)
  other vias: 119.38,48.26
N$126  (via drill 0.8 pad 1.27)
  other vias: 121.92,48.26
N$127  (via drill 0.8 pad 1.27)
  other vias: 124.46,48.26
N$128  (via drill 0.8 pad 1.27)
  other vias: 127,48.26
N$129  (via drill 0.8 pad 1.27)
  other vias: 129.54,48.26
N$130  (via drill 0.8 pad 1.27)
  other vias: 132.08,48.26
N$131  (via drill 0.8 pad 1.27)
  other vias: 134.62,48.26
N$132  (via drill 0.8 pad 1.27)
  other vias: 137.16,48.26
N$133  (via drill 0.8 pad 1.27)
  other vias: 139.7,48.26
N$134  (via drill 0.8 pad 1.27)
  other vias: 142.24,48.26
N$135  (via drill 0.8 pad 1.27)
  other vias: 144.78,48.26
N$136  (via drill 0.8 pad 1.27)
  other vias: 147.32,48.26
N$137  (via drill 0.8 pad 1.27)
  other vias: 149.86,48.26
N$138  (via drill 0.8 pad 1.27)
  other vias: 152.4,48.26
N$139  (via drill 0.8 pad 1.27)
  other vias: 152.4,45.72
N$140  (via drill 0.8 pad 1.27)
  other vias: 152.4,43.18
N$141  (via drill 0.8 pad 1.27)
  other vias: 152.4,40.64
N$142  (via drill 0.8 pad 1.27)
  other vias: 152.4,38.1
N$143  (via drill 0.8 pad 1.27)
  other vias: 152.4,35.56
N$144  (via drill 0.8 pad 1.27)
  other vias: 152.4,33.02
N$145  (via drill 0.8 pad 1.27)
  other vias: 152.4,30.48
N$146  (via drill 0.8 pad 1.27)
  other vias: 152.4,27.94
N$147  (via drill 0.8 pad 1.27)
  other vias: 152.4,25.4
N$148  (via drill 0.8 pad 1.27)
  other vias: 152.4,22.86
N$149  (via drill 0.8 pad 1.27)
  other vias: 152.4,20.32
N$150  (via drill 0.8 pad 1.27)
  other vias: 152.4,17.78
N$151  (via drill 0.8 pad 1.27)
  other vias: 152.4,15.24
N$152  (via drill 0.8 pad 1.27)
  other vias: 152.4,12.7
N$153  (via drill 0.8 pad 1.27)
  other vias: 152.4,10.16
N$154  (via drill 0.8 pad 1.27)
  other vias: 149.86,10.16
N$155  (via drill 0.8 pad 1.27)
  other vias: 147.32,10.16
N$156  (via drill 0.8 pad 1.27)
  other vias: 144.78,10.16
N$157  (via drill 0.8 pad 1.27)
  other vias: 142.24,10.16
N$158  (via drill 0.8 pad 1.27)
  other vias: 139.7,10.16
N$159  (via drill 0.8 pad 1.27)
  other vias: 139.7,7.62
N$160  (via drill 0.8 pad 1.27)
  other vias: 142.24,7.62
N$161  (via drill 0.8 pad 1.27)
  other vias: 144.78,7.62
N$162  (via drill 0.8 pad 1.27)
  other vias: 147.32,7.62
N$163  (via drill 0.8 pad 1.27)
  other vias: 147.32,5.08
N$164  (via drill 0.8 pad 1.27)
  other vias: 144.78,5.08
N$165  (via drill 0.8 pad 1.27)
  other vias: 142.24,5.08
N$166  (via drill 0.8 pad 1.27)
  other vias: 139.7,5.08
N$167  (via drill 0.8 pad 1.27)
  other vias: 109.22,5.08
N$168  (via drill 0.8 pad 1.27)
  other vias: 111.76,5.08
N$169  (via drill 0.8 pad 1.27)
  other vias: 114.3,5.08
N$170  (via drill 0.8 pad 1.27)
  other vias: 116.84,5.08
N$171  (via drill 0.8 pad 1.27)
  other vias: 119.38,5.08
N$172  (via drill 0.8 pad 1.27)
  other vias: 121.92,5.08
N$173  (via drill 0.8 pad 1.27)
  other vias: 124.46,5.08
N$174  (via drill 0.8 pad 1.27)
  other vias: 127,5.08
N$175  (via drill 0.8 pad 1.27)
  other vias: 129.54,5.08
N$176  (via drill 0.8 pad 1.27)
  other vias: 132.08,5.08
N$177  (via drill 0.8 pad 1.27)
  other vias: 134.62,5.08
N$178  (via drill 0.8 pad 1.27)
  other vias: 137.16,5.08
N$179  (via drill 0.8 pad 1.27)
  other vias: 111.76,7.62
N$180  (via drill 0.8 pad 1.27)
  other vias: 114.3,7.62
N$181  (via drill 0.8 pad 1.27)
  other vias: 116.84,7.62
N$182  (via drill 0.8 pad 1.27)
  other vias: 119.38,7.62
N$183  (via drill 0.8 pad 1.27)
  other vias: 121.92,7.62
N$184  (via drill 0.8 pad 1.27)
  other vias: 124.46,7.62
N$185  (via drill 0.8 pad 1.27)
  other vias: 127,7.62
N$186  (via drill 0.8 pad 1.27)
  other vias: 129.54,7.62
N$187  (via drill 0.8 pad 1.27)
  other vias: 132.08,7.62
N$188  (via drill 0.8 pad 1.27)
  other vias: 134.62,7.62
N$189  (via drill 0.8 pad 1.27)
  other vias: 137.16,7.62
N$190  (via drill 0.8 pad 1.27)
  other vias: 111.76,10.16
N$191  (via drill 0.8 pad 1.27)
  other vias: 114.3,10.16
N$192  (via drill 0.8 pad 1.27)
  other vias: 116.84,10.16
N$193  (via drill 0.8 pad 1.27)
  other vias: 119.38,10.16
N$194  (via drill 0.8 pad 1.27)
  other vias: 121.92,10.16
N$195  (via drill 0.8 pad 1.27)
  other vias: 124.46,10.16
N$196  (via drill 0.8 pad 1.27)
  other vias: 127,10.16
N$197  (via drill 0.8 pad 1.27)
  other vias: 129.54,10.16
N$198  (via drill 0.8 pad 1.27)
  other vias: 132.08,10.16
N$199  (via drill 0.8 pad 1.27)
  other vias: 134.62,10.16
N$200  (via drill 0.8 pad 1.27)
  other vias: 137.16,10.16
N$201  (via drill 0.8 pad 1.27)
  other vias: 111.76,12.7
N$202  (via drill 0.8 pad 1.27)
  other vias: 114.3,12.7
N$203  (via drill 0.8 pad 1.27)
  other vias: 116.84,12.7
N$204  (via drill 0.8 pad 1.27)
  other vias: 119.38,12.7
N$205  (via drill 0.8 pad 1.27)
  other vias: 121.92,12.7
N$206  (via drill 0.8 pad 1.27)
  other vias: 124.46,12.7
N$207  (via drill 0.8 pad 1.27)
  other vias: 127,12.7
N$208  (via drill 0.8 pad 1.27)
  other vias: 129.54,12.7
N$209  (via drill 0.8 pad 1.27)
  other vias: 132.08,12.7
N$210  (via drill 0.8 pad 1.27)
  other vias: 134.62,12.7
N$211  (via drill 0.8 pad 1.27)
  other vias: 137.16,12.7
N$212  (via drill 0.8 pad 1.27)
  other vias: 139.7,12.7
N$213  (via drill 0.8 pad 1.27)
  other vias: 142.24,12.7
N$214  (via drill 0.8 pad 1.27)
  other vias: 144.78,12.7
N$215  (via drill 0.8 pad 1.27)
  other vias: 147.32,12.7
N$216  (via drill 0.8 pad 1.27)
  other vias: 149.86,12.7
N$217  (via drill 0.8 pad 1.27)
  other vias: 149.86,17.78
N$218  (via drill 0.8 pad 1.27)
  other vias: 149.86,15.24
N$219  (via drill 0.8 pad 1.27)
  other vias: 149.86,20.32
N$220  (via drill 0.8 pad 1.27)
  other vias: 147.32,20.32
N$221  (via drill 0.8 pad 1.27)
  other vias: 144.78,20.32
N$222  (via drill 0.8 pad 1.27)
  other vias: 142.24,20.32
N$223  (via drill 0.8 pad 1.27)
  other vias: 139.7,20.32
N$224  (via drill 0.8 pad 1.27)
  other vias: 139.7,17.78
N$225  (via drill 0.8 pad 1.27)
  other vias: 142.24,17.78
N$226  (via drill 0.8 pad 1.27)
  other vias: 144.78,17.78
N$227  (via drill 0.8 pad 1.27)
  other vias: 147.32,17.78
N$228  (via drill 0.8 pad 1.27)
  other vias: 147.32,15.24
N$229  (via drill 0.8 pad 1.27)
  other vias: 144.78,15.24
N$230  (via drill 0.8 pad 1.27)
  other vias: 142.24,15.24
N$231  (via drill 0.8 pad 1.27)
  other vias: 139.7,15.24
N$232  (via drill 0.8 pad 1.27)
  other vias: 111.76,15.24
N$233  (via drill 0.8 pad 1.27)
  other vias: 114.3,15.24
N$234  (via drill 0.8 pad 1.27)
  other vias: 116.84,15.24
N$235  (via drill 0.8 pad 1.27)
  other vias: 119.38,15.24
N$236  (via drill 0.8 pad 1.27)
  other vias: 121.92,15.24
N$237  (via drill 0.8 pad 1.27)
  other vias: 124.46,15.24
N$238  (via drill 0.8 pad 1.27)
  other vias: 127,15.24
N$239  (via drill 0.8 pad 1.27)
  other vias: 129.54,15.24
N$240  (via drill 0.8 pad 1.27)
  other vias: 132.08,15.24
N$241  (via drill 0.8 pad 1.27)
  other vias: 134.62,15.24
N$242  (via drill 0.8 pad 1.27)
  other vias: 137.16,15.24
N$243  (via drill 0.8 pad 1.27)
  other vias: 111.76,17.78
N$244  (via drill 0.8 pad 1.27)
  other vias: 114.3,17.78
N$245  (via drill 0.8 pad 1.27)
  other vias: 116.84,17.78
N$246  (via drill 0.8 pad 1.27)
  other vias: 119.38,17.78
N$247  (via drill 0.8 pad 1.27)
  other vias: 121.92,17.78
N$248  (via drill 0.8 pad 1.27)
  other vias: 124.46,17.78
N$249  (via drill 0.8 pad 1.27)
  other vias: 127,17.78
N$250  (via drill 0.8 pad 1.27)
  other vias: 129.54,17.78
N$251  (via drill 0.8 pad 1.27)
  other vias: 132.08,17.78
N$252  (via drill 0.8 pad 1.27)
  other vias: 134.62,17.78
N$253  (via drill 0.8 pad 1.27)
  other vias: 137.16,17.78
N$254  (via drill 0.8 pad 1.27)
  other vias: 111.76,20.32
N$255  (via drill 0.8 pad 1.27)
  other vias: 114.3,20.32
N$256  (via drill 0.8 pad 1.27)
  other vias: 116.84,20.32
N$257  (via drill 0.8 pad 1.27)
  other vias: 119.38,20.32
N$258  (via drill 0.8 pad 1.27)
  other vias: 121.92,20.32
N$259  (via drill 0.8 pad 1.27)
  other vias: 124.46,20.32
N$260  (via drill 0.8 pad 1.27)
  other vias: 127,20.32
N$261  (via drill 0.8 pad 1.27)
  other vias: 129.54,20.32
N$262  (via drill 0.8 pad 1.27)
  other vias: 132.08,20.32
N$263  (via drill 0.8 pad 1.27)
  other vias: 134.62,20.32
N$264  (via drill 0.8 pad 1.27)
  other vias: 137.16,20.32
N$265  (via drill 0.8 pad 1.27)
  other vias: 111.76,22.86
N$266  (via drill 0.8 pad 1.27)
  other vias: 114.3,22.86
N$267  (via drill 0.8 pad 1.27)
  other vias: 116.84,22.86
N$268  (via drill 0.8 pad 1.27)
  other vias: 119.38,22.86
N$269  (via drill 0.8 pad 1.27)
  other vias: 121.92,22.86
N$270  (via drill 0.8 pad 1.27)
  other vias: 124.46,22.86
N$271  (via drill 0.8 pad 1.27)
  other vias: 127,22.86
N$272  (via drill 0.8 pad 1.27)
  other vias: 129.54,22.86
N$273  (via drill 0.8 pad 1.27)
  other vias: 132.08,22.86
N$274  (via drill 0.8 pad 1.27)
  other vias: 134.62,22.86
N$275  (via drill 0.8 pad 1.27)
  other vias: 137.16,22.86
N$276  (via drill 0.8 pad 1.27)
  other vias: 139.7,22.86
N$277  (via drill 0.8 pad 1.27)
  other vias: 142.24,22.86
N$278  (via drill 0.8 pad 1.27)
  other vias: 144.78,22.86
N$279  (via drill 0.8 pad 1.27)
  other vias: 147.32,22.86
N$280  (via drill 0.8 pad 1.27)
  other vias: 149.86,22.86
N$281  (via drill 0.8 pad 1.27)
  other vias: 149.86,27.94
N$282  (via drill 0.8 pad 1.27)
  other vias: 149.86,25.4
N$283  (via drill 0.8 pad 1.27)
  other vias: 149.86,30.48
N$284  (via drill 0.8 pad 1.27)
  other vias: 147.32,30.48
N$285  (via drill 0.8 pad 1.27)
  other vias: 144.78,30.48
N$286  (via drill 0.8 pad 1.27)
  other vias: 142.24,30.48
N$287  (via drill 0.8 pad 1.27)
  other vias: 139.7,30.48
N$288  (via drill 0.8 pad 1.27)
  other vias: 139.7,27.94
N$289  (via drill 0.8 pad 1.27)
  other vias: 142.24,27.94
N$290  (via drill 0.8 pad 1.27)
  other vias: 144.78,27.94
N$291  (via drill 0.8 pad 1.27)
  other vias: 147.32,27.94
N$292  (via drill 0.8 pad 1.27)
  other vias: 147.32,25.4
N$293  (via drill 0.8 pad 1.27)
  other vias: 144.78,25.4
N$294  (via drill 0.8 pad 1.27)
  other vias: 142.24,25.4
N$295  (via drill 0.8 pad 1.27)
  other vias: 139.7,25.4
N$296  (via drill 0.8 pad 1.27)
  other vias: 111.76,25.4
N$297  (via drill 0.8 pad 1.27)
  other vias: 114.3,25.4
N$298  (via drill 0.8 pad 1.27)
  other vias: 116.84,25.4
N$299  (via drill 0.8 pad 1.27)
  other vias: 119.38,25.4
N$300  (via drill 0.8 pad 1.27)
  other vias: 121.92,25.4
N$301  (via drill 0.8 pad 1.27)
  other vias: 124.46,25.4
N$302  (via drill 0.8 pad 1.27)
  other vias: 127,25.4
N$303  (via drill 0.8 pad 1.27)
  other vias: 129.54,25.4
N$304  (via drill 0.8 pad 1.27)
  other vias: 132.08,25.4
N$305  (via drill 0.8 pad 1.27)
  other vias: 134.62,25.4
N$306  (via drill 0.8 pad 1.27)
  other vias: 137.16,25.4
N$307  (via drill 0.8 pad 1.27)
  other vias: 111.76,27.94
N$308  (via drill 0.8 pad 1.27)
  other vias: 114.3,27.94
N$309  (via drill 0.8 pad 1.27)
  other vias: 116.84,27.94
N$310  (via drill 0.8 pad 1.27)
  other vias: 119.38,27.94
N$311  (via drill 0.8 pad 1.27)
  other vias: 121.92,27.94
N$312  (via drill 0.8 pad 1.27)
  other vias: 124.46,27.94
N$313  (via drill 0.8 pad 1.27)
  other vias: 127,27.94
N$314  (via drill 0.8 pad 1.27)
  other vias: 129.54,27.94
N$315  (via drill 0.8 pad 1.27)
  other vias: 132.08,27.94
N$316  (via drill 0.8 pad 1.27)
  other vias: 134.62,27.94
N$317  (via drill 0.8 pad 1.27)
  other vias: 137.16,27.94
N$318  (via drill 0.8 pad 1.27)
  other vias: 111.76,30.48
N$319  (via drill 0.8 pad 1.27)
  other vias: 114.3,30.48
N$320  (via drill 0.8 pad 1.27)
  other vias: 116.84,30.48
N$321  (via drill 0.8 pad 1.27)
  other vias: 119.38,30.48
N$322  (via drill 0.8 pad 1.27)
  other vias: 121.92,30.48
N$323  (via drill 0.8 pad 1.27)
  other vias: 124.46,30.48
N$324  (via drill 0.8 pad 1.27)
  other vias: 127,30.48
N$325  (via drill 0.8 pad 1.27)
  other vias: 129.54,30.48
N$326  (via drill 0.8 pad 1.27)
  other vias: 132.08,30.48
N$327  (via drill 0.8 pad 1.27)
  other vias: 134.62,30.48
N$328  (via drill 0.8 pad 1.27)
  other vias: 137.16,30.48
N$329  (via drill 0.8 pad 1.27)
  other vias: 111.76,33.02
N$330  (via drill 0.8 pad 1.27)
  other vias: 114.3,33.02
N$331  (via drill 0.8 pad 1.27)
  other vias: 116.84,33.02
N$332  (via drill 0.8 pad 1.27)
  other vias: 119.38,33.02
N$333  (via drill 0.8 pad 1.27)
  other vias: 121.92,33.02
N$334  (via drill 0.8 pad 1.27)
  other vias: 124.46,33.02
N$335  (via drill 0.8 pad 1.27)
  other vias: 127,33.02
N$336  (via drill 0.8 pad 1.27)
  other vias: 129.54,33.02
N$337  (via drill 0.8 pad 1.27)
  other vias: 132.08,33.02
N$338  (via drill 0.8 pad 1.27)
  other vias: 134.62,33.02
N$339  (via drill 0.8 pad 1.27)
  other vias: 137.16,33.02
N$340  (via drill 0.8 pad 1.27)
  other vias: 139.7,33.02
N$341  (via drill 0.8 pad 1.27)
  other vias: 142.24,33.02
N$342  (via drill 0.8 pad 1.27)
  other vias: 144.78,33.02
N$343  (via drill 0.8 pad 1.27)
  other vias: 147.32,33.02
N$344  (via drill 0.8 pad 1.27)
  other vias: 149.86,33.02
N$345  (via drill 0.8 pad 1.27)
  other vias: 149.86,38.1
N$346  (via drill 0.8 pad 1.27)
  other vias: 149.86,35.56
N$347  (via drill 0.8 pad 1.27)
  other vias: 149.86,40.64
N$348  (via drill 0.8 pad 1.27)
  other vias: 147.32,40.64
N$349  (via drill 0.8 pad 1.27)
  other vias: 144.78,40.64
N$350  (via drill 0.8 pad 1.27)
  other vias: 142.24,40.64
N$351  (via drill 0.8 pad 1.27)
  other vias: 139.7,40.64
N$352  (via drill 0.8 pad 1.27)
  other vias: 139.7,38.1
N$353  (via drill 0.8 pad 1.27)
  other vias: 142.24,38.1
N$354  (via drill 0.8 pad 1.27)
  other vias: 144.78,38.1
N$355  (via drill 0.8 pad 1.27)
  other vias: 147.32,38.1
N$356  (via drill 0.8 pad 1.27)
  other vias: 147.32,35.56
N$357  (via drill 0.8 pad 1.27)
  other vias: 144.78,35.56
N$358  (via drill 0.8 pad 1.27)
  other vias: 142.24,35.56
N$359  (via drill 0.8 pad 1.27)
  other vias: 139.7,35.56
N$360  (via drill 0.8 pad 1.27)
  other vias: 111.76,35.56
N$361  (via drill 0.8 pad 1.27)
  other vias: 114.3,35.56
N$362  (via drill 0.8 pad 1.27)
  other vias: 116.84,35.56
N$363  (via drill 0.8 pad 1.27)
  other vias: 119.38,35.56
N$364  (via drill 0.8 pad 1.27)
  other vias: 121.92,35.56
N$365  (via drill 0.8 pad 1.27)
  other vias: 124.46,35.56
N$366  (via drill 0.8 pad 1.27)
  other vias: 127,35.56
N$367  (via drill 0.8 pad 1.27)
  other vias: 129.54,35.56
N$368  (via drill 0.8 pad 1.27)
  other vias: 132.08,35.56
N$369  (via drill 0.8 pad 1.27)
  other vias: 134.62,35.56
N$370  (via drill 0.8 pad 1.27)
  other vias: 137.16,35.56
N$371  (via drill 0.8 pad 1.27)
  other vias: 111.76,38.1
N$372  (via drill 0.8 pad 1.27)
  other vias: 114.3,38.1
N$373  (via drill 0.8 pad 1.27)
  other vias: 116.84,38.1
N$374  (via drill 0.8 pad 1.27)
  other vias: 119.38,38.1
N$375  (via drill 0.8 pad 1.27)
  other vias: 121.92,38.1
N$376  (via drill 0.8 pad 1.27)
  other vias: 124.46,38.1
N$377  (via drill 0.8 pad 1.27)
  other vias: 127,38.1
N$378  (via drill 0.8 pad 1.27)
  other vias: 129.54,38.1
N$379  (via drill 0.8 pad 1.27)
  other vias: 132.08,38.1
N$380  (via drill 0.8 pad 1.27)
  other vias: 134.62,38.1
N$381  (via drill 0.8 pad 1.27)
  other vias: 137.16,38.1
N$382  (via drill 0.8 pad 1.27)
  other vias: 111.76,40.64
N$383  (via drill 0.8 pad 1.27)
  other vias: 114.3,40.64
N$384  (via drill 0.8 pad 1.27)
  other vias: 116.84,40.64
N$385  (via drill 0.8 pad 1.27)
  other vias: 119.38,40.64
N$386  (via drill 0.8 pad 1.27)
  other vias: 121.92,40.64
N$387  (via drill 0.8 pad 1.27)
  other vias: 124.46,40.64
N$388  (via drill 0.8 pad 1.27)
  other vias: 127,40.64
N$389  (via drill 0.8 pad 1.27)
  other vias: 129.54,40.64
N$390  (via drill 0.8 pad 1.27)
  other vias: 132.08,40.64
N$391  (via drill 0.8 pad 1.27)
  other vias: 134.62,40.64
N$392  (via drill 0.8 pad 1.27)
  other vias: 137.16,40.64
N$393  (via drill 0.8 pad 1.27)
  other vias: 149.86,43.18
N$394  (via drill 0.8 pad 1.27)
  other vias: 149.86,45.72
N$395  (via drill 0.8 pad 1.27)
  other vias: 147.32,45.72
N$396  (via drill 0.8 pad 1.27)
  other vias: 144.78,45.72
N$397  (via drill 0.8 pad 1.27)
  other vias: 142.24,45.72
N$398  (via drill 0.8 pad 1.27)
  other vias: 139.7,45.72
N$399  (via drill 0.8 pad 1.27)
  other vias: 139.7,43.18
N$400  (via drill 0.8 pad 1.27)
  other vias: 142.24,43.18
N$401  (via drill 0.8 pad 1.27)
  other vias: 144.78,43.18
N$402  (via drill 0.8 pad 1.27)
  other vias: 147.32,43.18
N$403  (via drill 0.8 pad 1.27)
  other vias: 111.76,43.18
N$404  (via drill 0.8 pad 1.27)
  other vias: 114.3,43.18
N$405  (via drill 0.8 pad 1.27)
  other vias: 116.84,43.18
N$406  (via drill 0.8 pad 1.27)
  other vias: 119.38,43.18
N$407  (via drill 0.8 pad 1.27)
  other vias: 121.92,43.18
N$408  (via drill 0.8 pad 1.27)
  other vias: 124.46,43.18
N$409  (via drill 0.8 pad 1.27)
  other vias: 127,43.18
N$410  (via drill 0.8 pad 1.27)
  other vias: 129.54,43.18
N$411  (via drill 0.8 pad 1.27)
  other vias: 132.08,43.18
N$412  (via drill 0.8 pad 1.27)
  other vias: 134.62,43.18
N$413  (via drill 0.8 pad 1.27)
  other vias: 137.16,43.18
N$414  (via drill 0.8 pad 1.27)
  other vias: 111.76,45.72
N$415  (via drill 0.8 pad 1.27)
  other vias: 114.3,45.72
N$416  (via drill 0.8 pad 1.27)
  other vias: 116.84,45.72
N$417  (via drill 0.8 pad 1.27)
  other vias: 119.38,45.72
N$418  (via drill 0.8 pad 1.27)
  other vias: 121.92,45.72
N$419  (via drill 0.8 pad 1.27)
  other vias: 124.46,45.72
N$420  (via drill 0.8 pad 1.27)
  other vias: 127,45.72
N$421  (via drill 0.8 pad 1.27)
  other vias: 129.54,45.72
N$422  (via drill 0.8 pad 1.27)
  other vias: 132.08,45.72
N$423  (via drill 0.8 pad 1.27)
  other vias: 134.62,45.72
N$424  (via drill 0.8 pad 1.27)
  other vias: 137.16,45.72
N$425  (via drill 0.8 pad 1.27)
  other vias: 58.42,5.08
N$426  (via drill 0.8 pad 1.27)
  other vias: 58.42,7.62
N$427  (via drill 0.8 pad 1.27)
  other vias: 58.42,10.16
N$428  (via drill 0.8 pad 1.27)
  other vias: 58.42,2.54
N$429  (via drill 0.8 pad 1.27)
  other vias: 60.96,2.54
N$430  (via drill 0.8 pad 1.27)
  other vias: 63.5,2.54
N$431  (via drill 0.8 pad 1.27)
  other vias: 66.04,2.54
N$432  (via drill 0.8 pad 1.27)
  other vias: 68.58,2.54
N$433  (via drill 0.8 pad 1.27)
  other vias: 71.12,2.54
N$434  (via drill 0.8 pad 1.27)
  other vias: 73.66,2.54
N$435  (via drill 0.8 pad 1.27)
  other vias: 76.2,2.54
N$436  (via drill 0.8 pad 1.27)
  other vias: 78.74,2.54
N$437  (via drill 0.8 pad 1.27)
  other vias: 81.28,2.54
N$438  (via drill 0.8 pad 1.27)
  other vias: 83.82,2.54
N$439  (via drill 0.8 pad 1.27)
  other vias: 86.36,2.54
N$440  (via drill 0.8 pad 1.27)
  other vias: 88.9,2.54
N$441  (via drill 0.8 pad 1.27)
  other vias: 91.44,2.54
N$442  (via drill 0.8 pad 1.27)
  other vias: 93.98,2.54
N$443  (via drill 0.8 pad 1.27)
  other vias: 96.52,2.54
N$444  (via drill 0.8 pad 1.27)
  other vias: 99.06,2.54
N$445  (via drill 0.8 pad 1.27)
  other vias: 101.6,2.54
N$446  (via drill 0.8 pad 1.27)
  other vias: 101.6,7.62
N$447  (via drill 0.8 pad 1.27)
  other vias: 101.6,5.08
N$448
  Top 0.305: U2.14 128.29,66.06 129.54,67.31 130.81,67.31 U1.14
N$452  (via drill 0.8 pad 1.27)
  other vias: 60.96,10.16
N$453  (via drill 0.8 pad 1.27)
  other vias: 60.96,7.62
N$454  (via drill 0.8 pad 1.27)
  other vias: 101.6,10.16
N$455  (via drill 0.8 pad 1.27)
  other vias: 99.06,10.16
N$456  (via drill 0.8 pad 1.27)
  other vias: 96.52,10.16
N$457  (via drill 0.8 pad 1.27)
  other vias: 93.98,10.16
N$458  (via drill 0.8 pad 1.27)
  other vias: 91.44,10.16
N$459  (via drill 0.8 pad 1.27)
  other vias: 91.44,7.62
N$460  (via drill 0.8 pad 1.27)
  other vias: 93.98,7.62
N$461  (via drill 0.8 pad 1.27)
  other vias: 96.52,7.62
N$462  (via drill 0.8 pad 1.27)
  other vias: 99.06,7.62
N$463  (via drill 0.8 pad 1.27)
  other vias: 99.06,5.08
N$464  (via drill 0.8 pad 1.27)
  other vias: 96.52,5.08
N$465  (via drill 0.8 pad 1.27)
  other vias: 93.98,5.08
N$466  (via drill 0.8 pad 1.27)
  other vias: 91.44,5.08
N$467  (via drill 0.8 pad 1.27)
  other vias: 60.96,5.08
N$468  (via drill 0.8 pad 1.27)
  other vias: 63.5,5.08
N$469  (via drill 0.8 pad 1.27)
  other vias: 66.04,5.08
N$470  (via drill 0.8 pad 1.27)
  other vias: 68.58,5.08
N$471  (via drill 0.8 pad 1.27)
  other vias: 71.12,5.08
N$472  (via drill 0.8 pad 1.27)
  other vias: 73.66,5.08
N$473  (via drill 0.8 pad 1.27)
  other vias: 76.2,5.08
N$474  (via drill 0.8 pad 1.27)
  other vias: 78.74,5.08
N$475  (via drill 0.8 pad 1.27)
  other vias: 81.28,5.08
N$476  (via drill 0.8 pad 1.27)
  other vias: 83.82,5.08
N$477  (via drill 0.8 pad 1.27)
  other vias: 86.36,5.08
N$478  (via drill 0.8 pad 1.27)
  other vias: 88.9,5.08
N$479  (via drill 0.8 pad 1.27)
  other vias: 63.5,7.62
N$480  (via drill 0.8 pad 1.27)
  other vias: 66.04,7.62
N$481  (via drill 0.8 pad 1.27)
  other vias: 68.58,7.62
N$482  (via drill 0.8 pad 1.27)
  other vias: 71.12,7.62
N$483  (via drill 0.8 pad 1.27)
  other vias: 73.66,7.62
N$484  (via drill 0.8 pad 1.27)
  other vias: 76.2,7.62
N$485  (via drill 0.8 pad 1.27)
  other vias: 78.74,7.62
N$486  (via drill 0.8 pad 1.27)
  other vias: 81.28,7.62
N$487  (via drill 0.8 pad 1.27)
  other vias: 83.82,7.62
N$488  (via drill 0.8 pad 1.27)
  other vias: 86.36,7.62
N$489  (via drill 0.8 pad 1.27)
  other vias: 88.9,7.62
N$490  (via drill 0.8 pad 1.27)
  other vias: 63.5,10.16